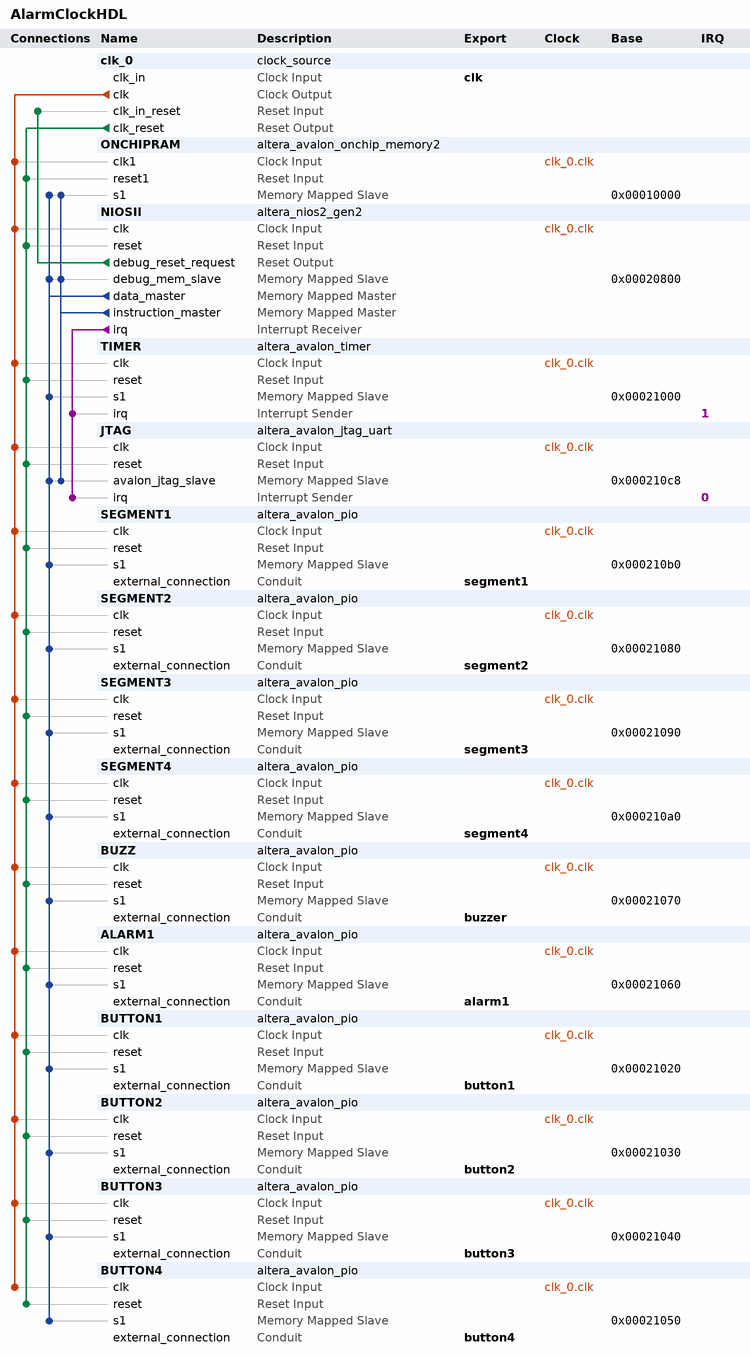
[diagram p0: system contents]
# Platform Designer (Qsys) system AlarmClockHDL, Cyclone V 5CSEMA5F31C6
# Parameters at their usual value, and those the tool derives, are not listed.
package require -exact qsys 18.1
create_system AlarmClockHDL
set_project_property DEVICE_FAMILY {Cyclone V}
set_project_property DEVICE 5CSEMA5F31C6

add_instance clk_0 clock_source 18.1
set_instance_parameter_value clk_0 clockFrequency 50000000

add_instance ONCHIPRAM altera_avalon_onchip_memory2 18.1
set_instance_parameter_value ONCHIPRAM dataWidth 32
set_instance_parameter_value ONCHIPRAM dualPort false
set_instance_parameter_value ONCHIPRAM initMemContent true
set_instance_parameter_value ONCHIPRAM initializationFileName onchip_mem.hex
set_instance_parameter_value ONCHIPRAM memorySize 40960

add_instance NIOSII altera_nios2_gen2 18.1
set_instance_parameter_value NIOSII dcache_size 2048
set_instance_parameter_value NIOSII exceptionSlave ONCHIPRAM.s1
set_instance_parameter_value NIOSII icache_size 4096
set_instance_parameter_value NIOSII impl Tiny
set_instance_parameter_value NIOSII resetSlave ONCHIPRAM.s1

add_instance TIMER altera_avalon_timer 18.1
set_instance_parameter_value TIMER period 250
set_instance_parameter_value TIMER periodUnits MSEC

add_instance JTAG altera_avalon_jtag_uart 18.1
set_instance_parameter_value JTAG simInteractiveOptions NO_INTERACTIVE_WINDOWS

add_instance SEGMENT1 altera_avalon_pio 18.1
set_instance_parameter_value SEGMENT1 direction Output
set_instance_parameter_value SEGMENT1 width 7

add_instance SEGMENT2 altera_avalon_pio 18.1
set_instance_parameter_value SEGMENT2 direction Output
set_instance_parameter_value SEGMENT2 width 7

add_instance SEGMENT3 altera_avalon_pio 18.1
set_instance_parameter_value SEGMENT3 direction Output
set_instance_parameter_value SEGMENT3 width 7

add_instance SEGMENT4 altera_avalon_pio 18.1
set_instance_parameter_value SEGMENT4 direction Output
set_instance_parameter_value SEGMENT4 width 7

add_instance BUZZ altera_avalon_pio 18.1
set_instance_parameter_value BUZZ direction Output
set_instance_parameter_value BUZZ width 2

add_instance ALARM1 altera_avalon_pio 18.1
set_instance_parameter_value ALARM1 direction Input
set_instance_parameter_value ALARM1 width 1

add_instance BUTTON1 altera_avalon_pio 18.1
set_instance_parameter_value BUTTON1 direction Input
set_instance_parameter_value BUTTON1 width 1

add_instance BUTTON2 altera_avalon_pio 18.1
set_instance_parameter_value BUTTON2 direction Input
set_instance_parameter_value BUTTON2 width 1

add_instance BUTTON3 altera_avalon_pio 18.1
set_instance_parameter_value BUTTON3 direction Input
set_instance_parameter_value BUTTON3 width 1

add_instance BUTTON4 altera_avalon_pio 18.1
set_instance_parameter_value BUTTON4 direction Input
set_instance_parameter_value BUTTON4 width 1

# connections
add_connection clk_0.clk ALARM1.clk clock
add_connection clk_0.clk BUTTON1.clk clock
add_connection clk_0.clk BUTTON2.clk clock
add_connection clk_0.clk BUTTON3.clk clock
add_connection clk_0.clk BUTTON4.clk clock
add_connection clk_0.clk BUZZ.clk clock
add_connection clk_0.clk JTAG.clk clock
add_connection clk_0.clk NIOSII.clk clock
add_connection clk_0.clk ONCHIPRAM.clk1 clock
add_connection clk_0.clk SEGMENT1.clk clock
add_connection clk_0.clk SEGMENT2.clk clock
add_connection clk_0.clk SEGMENT3.clk clock
add_connection clk_0.clk SEGMENT4.clk clock
add_connection clk_0.clk TIMER.clk clock
add_connection clk_0.clk_reset ALARM1.reset reset
add_connection clk_0.clk_reset BUTTON1.reset reset
add_connection clk_0.clk_reset BUTTON2.reset reset
add_connection clk_0.clk_reset BUTTON3.reset reset
add_connection clk_0.clk_reset BUTTON4.reset reset
add_connection clk_0.clk_reset BUZZ.reset reset
add_connection clk_0.clk_reset JTAG.reset reset
add_connection clk_0.clk_reset NIOSII.reset reset
add_connection clk_0.clk_reset ONCHIPRAM.reset1 reset
add_connection clk_0.clk_reset SEGMENT1.reset reset
add_connection clk_0.clk_reset SEGMENT2.reset reset
add_connection clk_0.clk_reset SEGMENT3.reset reset
add_connection clk_0.clk_reset SEGMENT4.reset reset
add_connection clk_0.clk_reset TIMER.reset reset
add_connection NIOSII.debug_reset_request clk_0.clk_in_reset reset
add_connection NIOSII.data_master ALARM1.s1 avalon
set_connection_parameter_value NIOSII.data_master/ALARM1.s1 baseAddress 0x00021060
add_connection NIOSII.data_master BUTTON1.s1 avalon
set_connection_parameter_value NIOSII.data_master/BUTTON1.s1 baseAddress 0x00021020
add_connection NIOSII.data_master BUTTON2.s1 avalon
set_connection_parameter_value NIOSII.data_master/BUTTON2.s1 baseAddress 0x00021030
add_connection NIOSII.data_master BUTTON3.s1 avalon
set_connection_parameter_value NIOSII.data_master/BUTTON3.s1 baseAddress 0x00021040
add_connection NIOSII.data_master BUTTON4.s1 avalon
set_connection_parameter_value NIOSII.data_master/BUTTON4.s1 baseAddress 0x00021050
add_connection NIOSII.data_master BUZZ.s1 avalon
set_connection_parameter_value NIOSII.data_master/BUZZ.s1 baseAddress 0x00021070
add_connection NIOSII.data_master JTAG.avalon_jtag_slave avalon
set_connection_parameter_value NIOSII.data_master/JTAG.avalon_jtag_slave baseAddress 0x000210c8
add_connection NIOSII.data_master NIOSII.debug_mem_slave avalon
set_connection_parameter_value NIOSII.data_master/NIOSII.debug_mem_slave baseAddress 0x00020800
add_connection NIOSII.data_master ONCHIPRAM.s1 avalon
set_connection_parameter_value NIOSII.data_master/ONCHIPRAM.s1 baseAddress 0x00010000
add_connection NIOSII.data_master SEGMENT1.s1 avalon
set_connection_parameter_value NIOSII.data_master/SEGMENT1.s1 baseAddress 0x000210b0
add_connection NIOSII.data_master SEGMENT2.s1 avalon
set_connection_parameter_value NIOSII.data_master/SEGMENT2.s1 baseAddress 0x00021080
add_connection NIOSII.data_master SEGMENT3.s1 avalon
set_connection_parameter_value NIOSII.data_master/SEGMENT3.s1 baseAddress 0x00021090
add_connection NIOSII.data_master SEGMENT4.s1 avalon
set_connection_parameter_value NIOSII.data_master/SEGMENT4.s1 baseAddress 0x000210a0
add_connection NIOSII.data_master TIMER.s1 avalon
set_connection_parameter_value NIOSII.data_master/TIMER.s1 baseAddress 0x00021000
add_connection NIOSII.instruction_master JTAG.avalon_jtag_slave avalon
set_connection_parameter_value NIOSII.instruction_master/JTAG.avalon_jtag_slave baseAddress 0x000210c8
add_connection NIOSII.instruction_master NIOSII.debug_mem_slave avalon
set_connection_parameter_value NIOSII.instruction_master/NIOSII.debug_mem_slave baseAddress 0x00020800
add_connection NIOSII.instruction_master ONCHIPRAM.s1 avalon
set_connection_parameter_value NIOSII.instruction_master/ONCHIPRAM.s1 baseAddress 0x00010000
add_connection NIOSII.irq JTAG.irq interrupt
set_connection_parameter_value NIOSII.irq/JTAG.irq irqNumber 0
add_connection NIOSII.irq TIMER.irq interrupt
set_connection_parameter_value NIOSII.irq/TIMER.irq irqNumber 1

# exported interfaces
add_interface alarm1 conduit end
set_interface_property alarm1 EXPORT_OF ALARM1.external_connection
add_interface button1 conduit end
set_interface_property button1 EXPORT_OF BUTTON1.external_connection
add_interface button2 conduit end
set_interface_property button2 EXPORT_OF BUTTON2.external_connection
add_interface button3 conduit end
set_interface_property button3 EXPORT_OF BUTTON3.external_connection
add_interface button4 conduit end
set_interface_property button4 EXPORT_OF BUTTON4.external_connection
add_interface buzzer conduit end
set_interface_property buzzer EXPORT_OF BUZZ.external_connection
add_interface clk clock sink
set_interface_property clk EXPORT_OF clk_0.clk_in
add_interface segment1 conduit end
set_interface_property segment1 EXPORT_OF SEGMENT1.external_connection
add_interface segment2 conduit end
set_interface_property segment2 EXPORT_OF SEGMENT2.external_connection
add_interface segment3 conduit end
set_interface_property segment3 EXPORT_OF SEGMENT3.external_connection
add_interface segment4 conduit end
set_interface_property segment4 EXPORT_OF SEGMENT4.external_connection

set_interconnect_requirement {$system} qsys_mm.clockCrossingAdapter HANDSHAKE
set_interconnect_requirement {$system} qsys_mm.enableEccProtection FALSE
set_interconnect_requirement {$system} qsys_mm.insertDefaultSlave FALSE
set_interconnect_requirement {$system} qsys_mm.maxAdditionalLatency 1

save_system AlarmClockHDL.qsys
